# Altium schematic sheet TopLevel.SchDoc
size A2; SheetNumber: 1; SheetTotal: 9
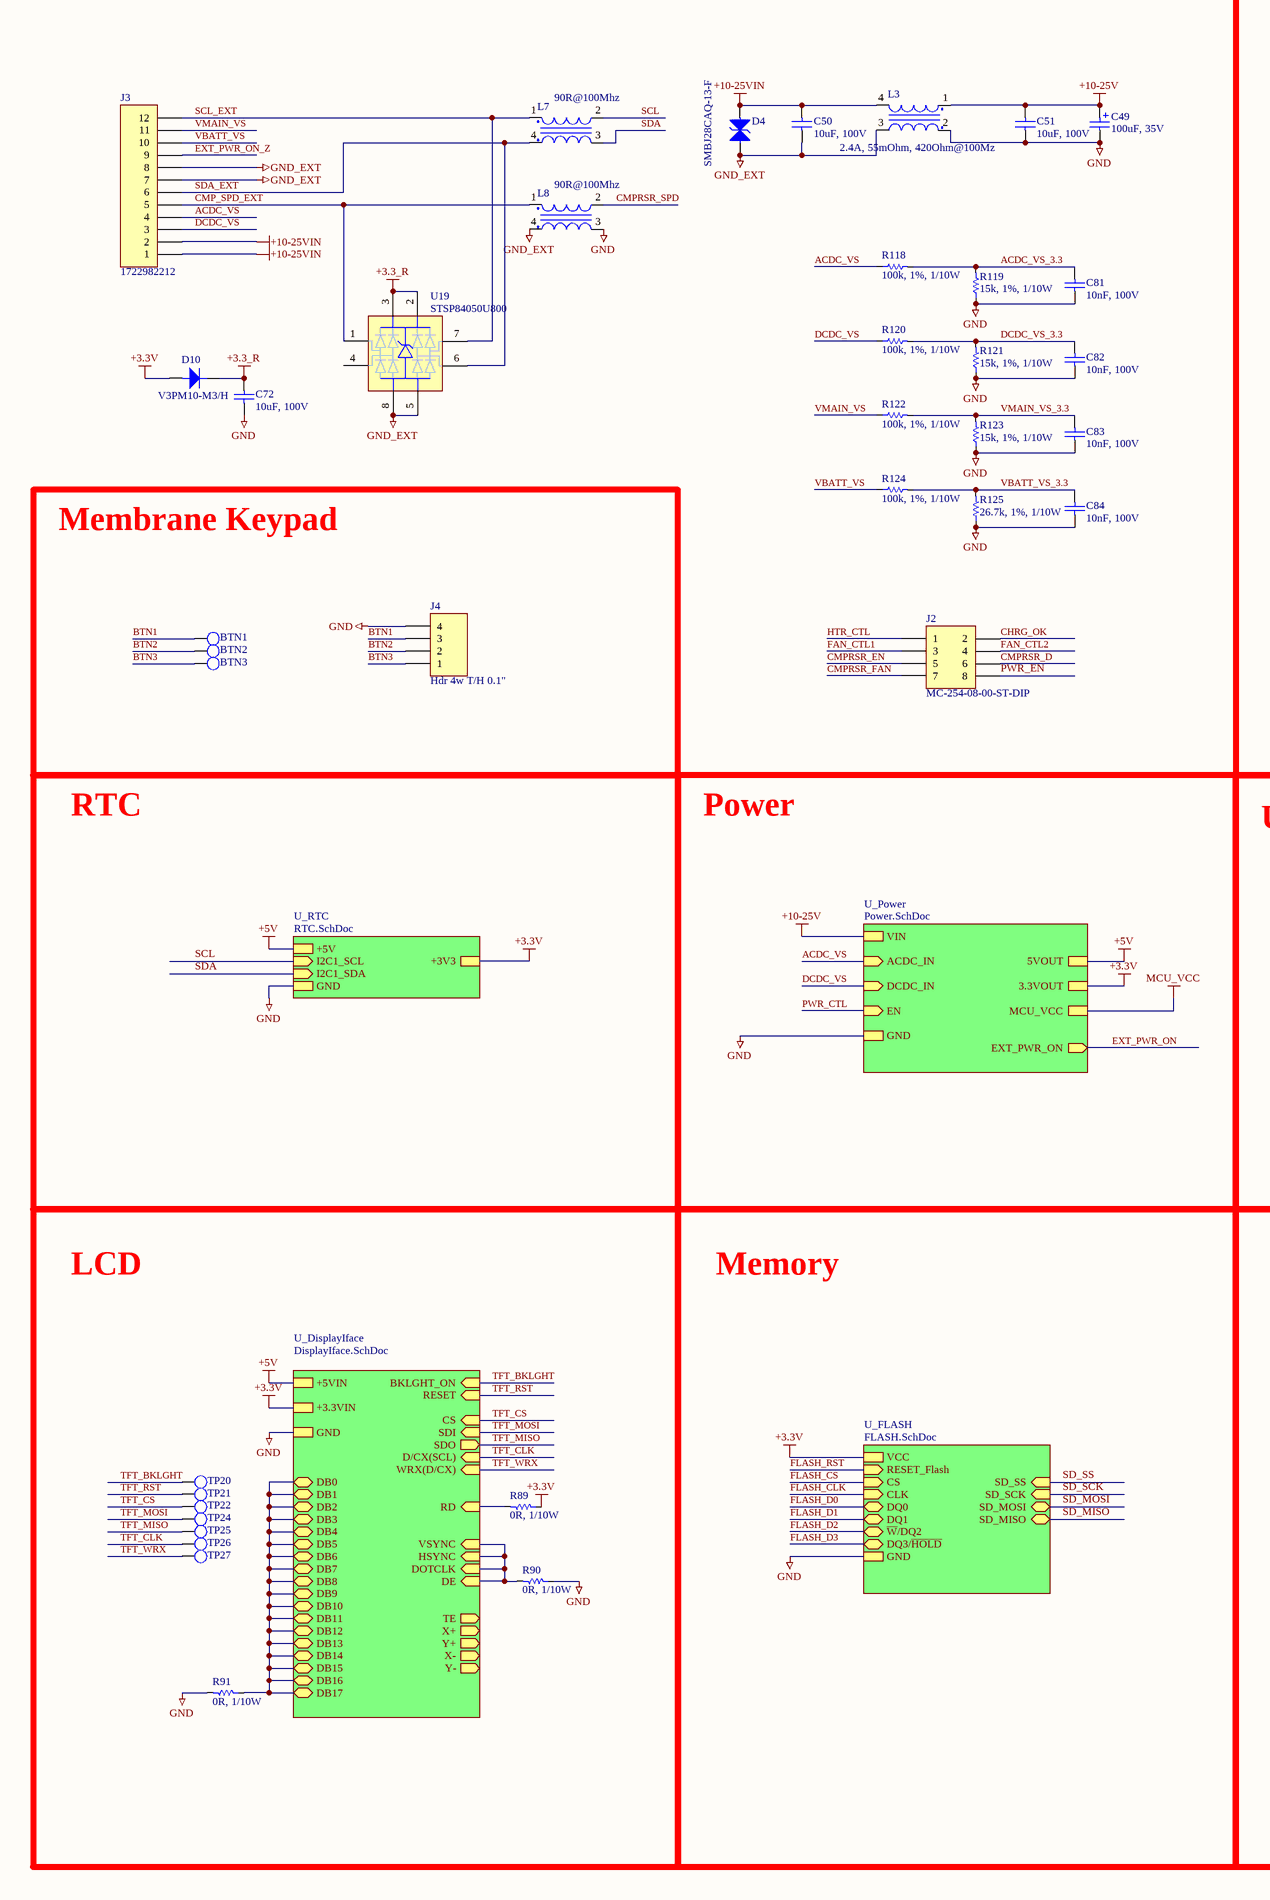
[diagram p0: TopLevel.SchDoc, left]
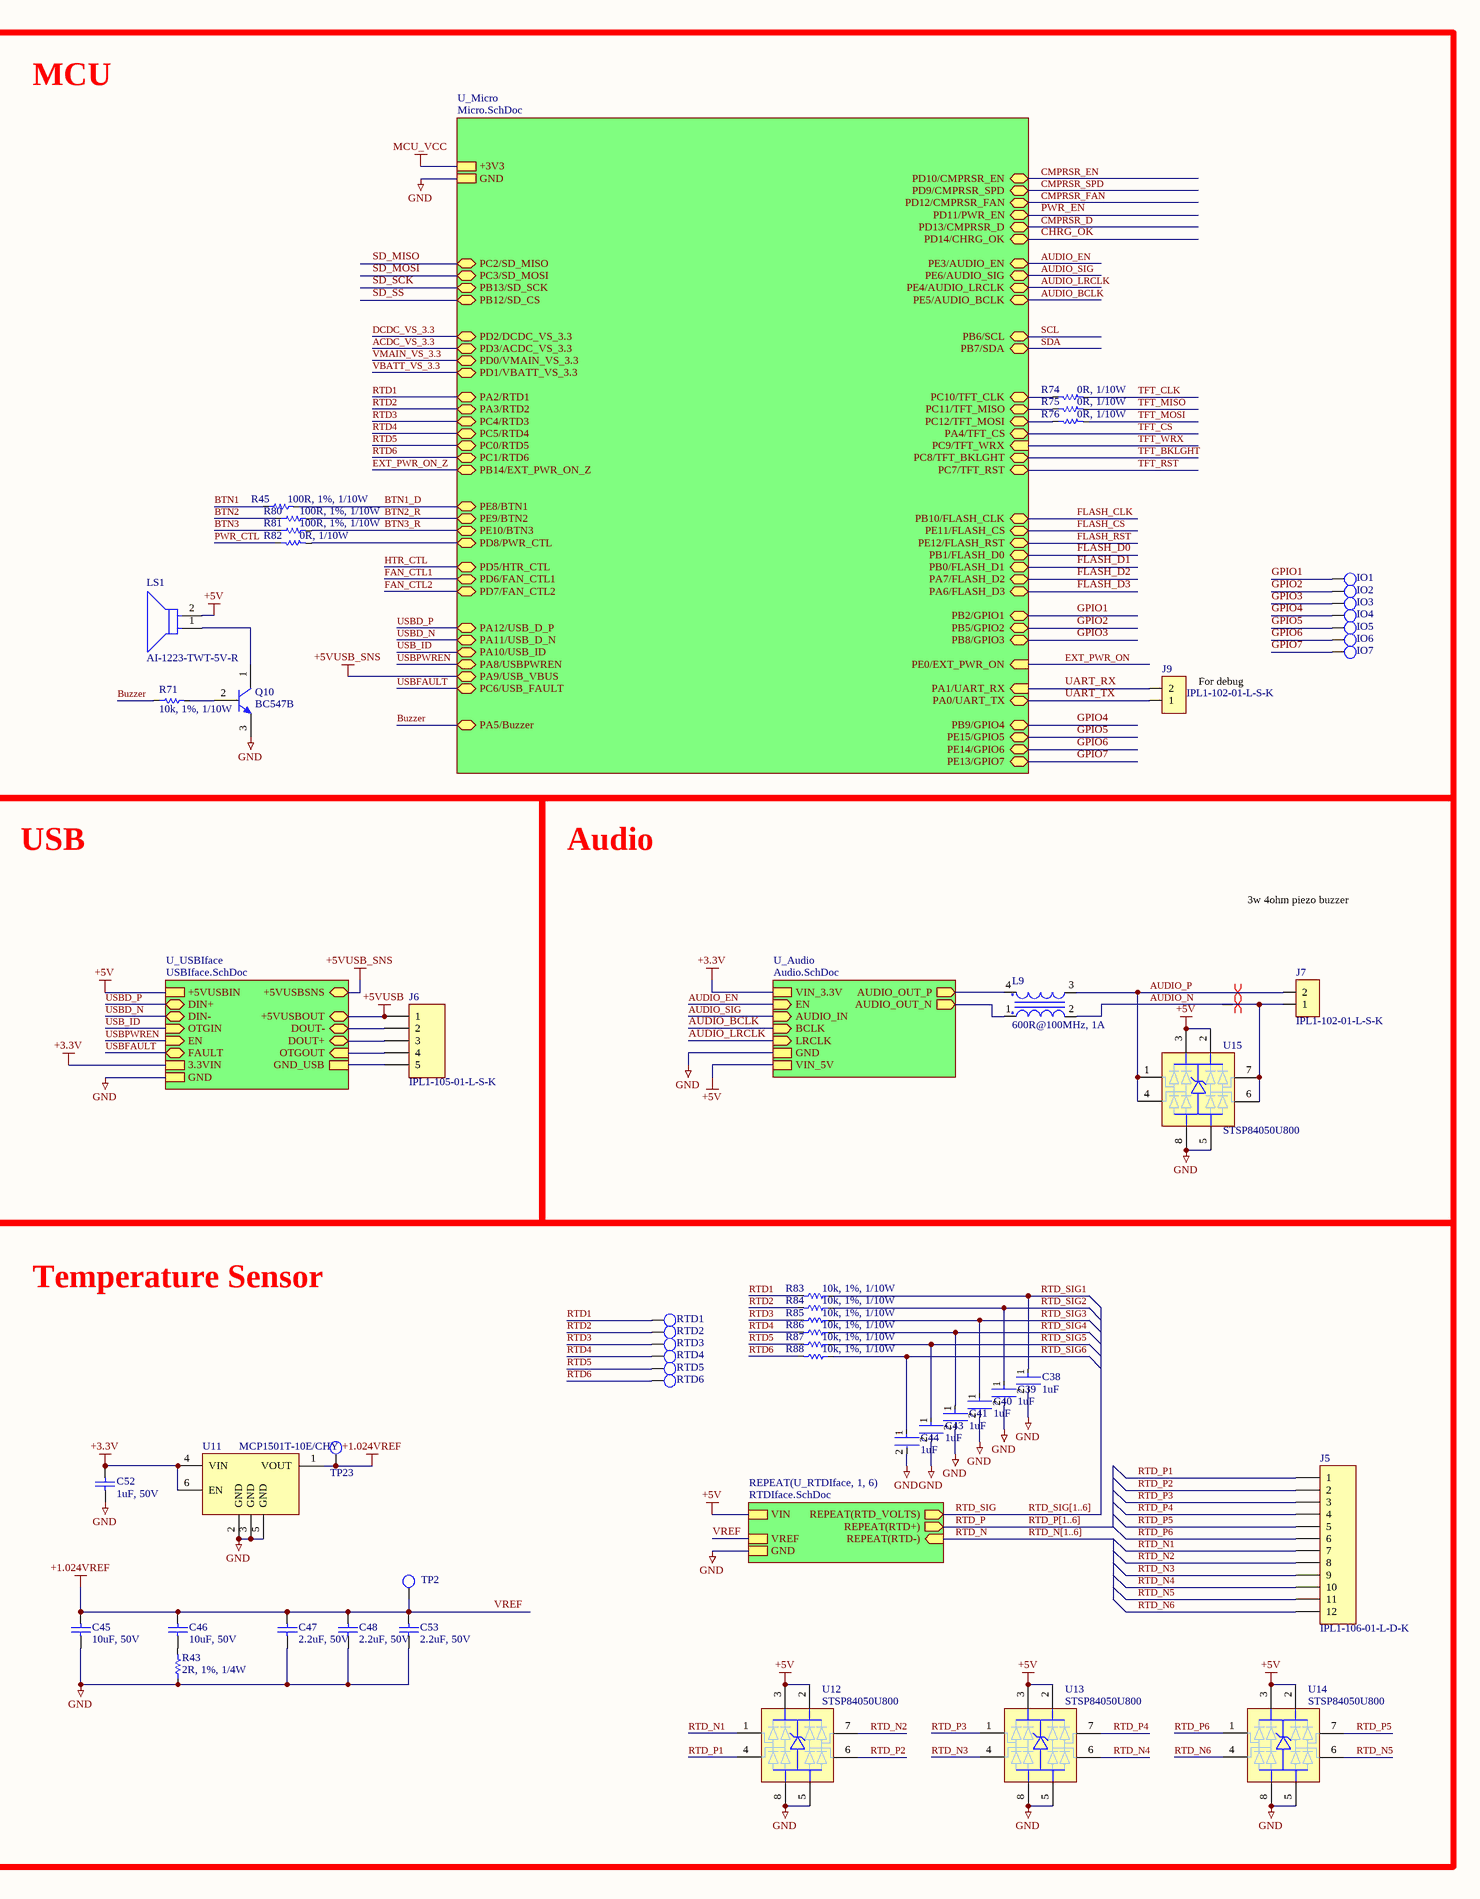
[diagram p1: TopLevel.SchDoc, right]

## Parts
BTN1  2mm  [TEST POINT 40 Mil]  (value not drawn)  (no BOM)
BTN2  2mm  [TEST POINT 40 Mil]  (value not drawn)  (no BOM)
BTN3  2mm  [TEST POINT 40 Mil]  (value not drawn)  (no BOM)
C38  1uF  [FP-CL10B105KO8NNNC-MFG]
C39  1uF  [FP-CL10B105KO8NNNC-MFG]
C40  1uF  [FP-CL10B105KO8NNNC-MFG]
C41  1uF  [FP-CL10B105KO8NNNC-MFG]
C43  1uF  [FP-CL10B105KO8NNNC-MFG]
C44  1uF  [FP-CL10B105KO8NNNC-MFG]
C45  10uF, 50V  [1206]
C46  10uF, 50V  [1206]
C47  2.2uF, 50V  [1206]
C48  2.2uF, 50V  [1206]
C49  100uF, 35V  [CAPAE7866X80L]
C50  10uF, 100V  [1210]
C51  10uF, 100V  [1210]
C52  1uF, 50V  [0805]
C53  2.2uF, 50V  [1206]
C72  10uF, 100V  [1210]
C81  10nF, 100V  [0603]
C82  10nF, 100V  [0603]
C83  10nF, 100V  [0603]
C84  10nF, 100V  [0603]
D4  SMBJ28CAQ-13-F  [SMB]
D10  V3PM10-M3/H  [SMP]
IO1  2mm  [TEST POINT 40 Mil]  (value not drawn)  (no BOM)
IO2  2mm  [TEST POINT 40 Mil]  (value not drawn)  (no BOM)
IO3  2mm  [TEST POINT 40 Mil]  (value not drawn)  (no BOM)
IO4  2mm  [TEST POINT 40 Mil]  (value not drawn)  (no BOM)
IO5  2mm  [TEST POINT 40 Mil]  (value not drawn)  (no BOM)
IO6  2mm  [TEST POINT 40 Mil]  (value not drawn)  (no BOM)
IO7  2mm  [TEST POINT 40 Mil]  (value not drawn)  (no BOM)
J2  MC-254-08-00-ST-DIP  [CONN_206832-0823]
J3  1722982212  [CONN_MOLEX_1722982212]
J4  Hdr 4w T/H 0.1"  [CONN_HDR_FRICTION_LOCK_2.54MM_4]
J5  IPL1-106-01-L-D-K  [CONN_SAMTEC_IPL1-106-XX-X-D]
J6  IPL1-105-01-L-S-K  [CONN_SAMTEC_IPL1-105-XX-X-S]
J7  IPL1-102-01-L-S-K  [CONN_SAMTEC_IPL1-102-XX-X-S]
J9  IPL1-102-01-L-S-K  [CONN_SAMTEC_IPL1-102-XX-X-S]
L3  2.4A, 55mOhm, 420Ohm@100Mz  [CHOKE_SMD_4.7X4.5]
L7  90R@100Mhz  [BOURNS_SRF2012]
L8  90R@100Mhz  [BOURNS_SRF2012]
L9  600R@100MHz, 1A  [DFN260P320X200-4L]
LS1  AI-1223-TWT-5V-R  [FP-AI-1223-TWT-5V-R-MFG]
Q10  BC547B  [ONSC-TO-92-3-29-11]
R43  2R, 1%, 1/4W  [1206]
R45  100R, 1%, 1/10W  [0603]
R71  10k, 1%, 1/10W  [0603]
R74  0R, 1/10W  [0603]
R75  0R, 1/10W  [0603]
R76  0R, 1/10W  [0603]
R80  100R, 1%, 1/10W  [0603]
R81  100R, 1%, 1/10W  [0603]
R82  0R, 1/10W  [0603]
R83  10k, 1%, 1/10W  [0603]
R84  10k, 1%, 1/10W  [0603]
R85  10k, 1%, 1/10W  [0603]
R86  10k, 1%, 1/10W  [0603]
R87  10k, 1%, 1/10W  [0603]
R88  10k, 1%, 1/10W  [0603]
R89  0R, 1/10W  [0603]
R90  0R, 1/10W  [0603]
R91  0R, 1/10W  [0603]
R118  100k, 1%, 1/10W  [0603]
R119  15k, 1%, 1/10W  [0603]
R120  100k, 1%, 1/10W  [0603]
R121  15k, 1%, 1/10W  [0603]
R122  100k, 1%, 1/10W  [0603]
R123  15k, 1%, 1/10W  [0603]
R124  100k, 1%, 1/10W  [0603]
R125  26.7k, 1%, 1/10W  [0603]
RTD1  2mm  [TEST POINT 40 Mil]  (value not drawn)  (no BOM)
RTD2  2mm  [TEST POINT 40 Mil]  (value not drawn)  (no BOM)
RTD3  2mm  [TEST POINT 40 Mil]  (value not drawn)  (no BOM)
RTD4  2mm  [TEST POINT 40 Mil]  (value not drawn)  (no BOM)
RTD5  2mm  [TEST POINT 40 Mil]  (value not drawn)  (no BOM)
RTD6  2mm  [TEST POINT 40 Mil]  (value not drawn)  (no BOM)
TP2  2mm  [TEST POINT 40 Mil]  (value not drawn)  (no BOM)
TP20  2mm  [TEST POINT 40 Mil]  (value not drawn)  (no BOM)
TP21  2mm  [TEST POINT 40 Mil]  (value not drawn)  (no BOM)
TP22  2mm  [TEST POINT 40 Mil]  (value not drawn)  (no BOM)
TP23  2mm  [TEST POINT 40 Mil]  (value not drawn)  (no BOM)
TP24  2mm  [TEST POINT 40 Mil]  (value not drawn)  (no BOM)
TP25  2mm  [TEST POINT 40 Mil]  (value not drawn)  (no BOM)
TP26  2mm  [TEST POINT 40 Mil]  (value not drawn)  (no BOM)
TP27  2mm  [TEST POINT 40 Mil]  (value not drawn)  (no BOM)
U11  MCP1501T-10E/CHY  [SOT23-6]
U12  STSP84050U800  [SOIC127P600X163-8N]
U13  STSP84050U800  [SOIC127P600X163-8N]
U14  STSP84050U800  [SOIC127P600X163-8N]
U15  STSP84050U800  [SOIC127P600X163-8N]
U19  STSP84050U800  [SOIC127P600X163-8N]

## Blocks framed on the sheet
MCU: IO1-IO7 J9 LS1 Q10 R45 R71 R74-R76 R80-R82
Membrane Keypad: BTN1-BTN3 J4
USB: J6
Audio: J7 L9 U15
LCD: R89-R91 TP20-TP22 TP24-TP27
Temperature Sensor: C38-C41 C43-C48 C52 C53 J5 R43 R83-R88 RTD1-RTD6 TP2 TP23 U11-U14

## Sub-sheets
REPEAT(U_RTDIface, 1, 6) = RTDIface.SchDoc: REPEAT(RTD_VOLTS) (out), GND, VIN, REPEAT(RTD+) (out), REPEAT(RTD-) (in), VREF
U_Audio = Audio.SchDoc: AUDIO_IN (in), EN (in), AUDIO_OUT_P (out), AUDIO_OUT_N (out), VIN_3.3V, BCLK (in), LRCLK (in), GND, VIN_5V
U_DisplayIface = DisplayIface.SchDoc: DB0 (bidir), DB1 (bidir), DB2 (bidir), DB3 (bidir), DB4 (bidir), DB5 (bidir), DB6 (bidir), DB7 (bidir), DB8 (bidir), DB9 (bidir), DB10 (bidir), DB11 (bidir), DB12 (bidir), DB13 (bidir), DB14 (bidir), DB15 (bidir), DB16 (bidir), DB17 (bidir), RD (in), +5VIN, +3.3VIN, GND, SDO (out), RESET (in), SDI (in), WRX(D/CX) (in), D/CX(SCL) (in), CS (in), BKLGHT_ON (in), TE (out), X+ (out), Y+ (out), X- (out), Y- (out), VSYNC (in), HSYNC (in), DOTCLK (in), DE (in)
U_FLASH = FLASH.SchDoc: VCC, RESET_Flash (in), CS (in), CLK (in), DQ0 (bidir), DQ1 (bidir), ~{W}/DQ2 (bidir), GND, DQ3/~{HOLD} (bidir), SD_SS (in), SD_SCK (in), SD_MOSI (bidir), SD_MISO (bidir)
U_Micro = Micro.SchDoc: PA10/USB_ID (bidir), PB10/FLASH_CLK (bidir), +3V3, GND, PE6/AUDIO_SIG (bidir), PA8/USBPWREN (bidir), PD13/CMPRSR_D (bidir), PB7/SDA (bidir), PA3/RTD2 (bidir), PD7/FAN_CTL2 (bidir), PC1/RTD6 (bidir), PC2/SD_MISO (bidir), PA11/USB_D_N (bidir), PA12/USB_D_P (bidir), PC3/SD_MOSI (bidir), PE12/FLASH_RST (bidir), PC8/TFT_BKLGHT (bidir), PC7/TFT_RST (bidir), PE11/FLASH_CS (bidir), PD10/CMPRSR_EN (bidir), PC9/TFT_WRX (in), PC10/TFT_CLK (bidir), PC11/TFT_MISO (bidir), PC12/TFT_MOSI (bidir), PA4/TFT_CS (bidir), PD9/CMPRSR_SPD (bidir), PB13/SD_SCK (bidir), PB12/SD_CS (bidir), PB6/SCL (bidir), PD6/FAN_CTL1 (bidir), PD14/CHRG_OK (bidir), PB14/EXT_PWR_ON_Z (bidir), PC4/RTD3 (bidir), PC5/RTD4 (bidir), PC0/RTD5 (bidir), PD8/PWR_CTL (bidir), PD5/HTR_CTL (bidir), PE8/BTN1 (bidir), PD0/VMAIN_VS_3.3 (bidir), PD1/VBATT_VS_3.3 (bidir), PD3/ACDC_VS_3.3 (bidir), PD2/DCDC_VS_3.3 (bidir), PE3/AUDIO_EN (bidir), PA2/RTD1 (bidir), PE9/BTN2 (bidir), PE10/BTN3 (bidir), PD12/CMPRSR_FAN (bidir), PE0/EXT_PWR_ON (in), PA5/Buzzer (bidir), PB1/FLASH_D0 (bidir), PB0/FLASH_D1 (bidir), PA7/FLASH_D2 (bidir), PA6/FLASH_D3 (bidir), PA9/USB_VBUS (bidir), PC6/USB_FAULT (bidir), PE4/AUDIO_LRCLK (bidir), PE5/AUDIO_BCLK (bidir), PA1/UART_RX (in), PA0/UART_TX (bidir), PB2/GPIO1 (bidir), PB8/GPIO3 (bidir), PB5/GPIO2 (bidir), PB9/GPIO4 (bidir), PE15/GPIO5 (bidir), PE14/GPIO6 (bidir), PE13/GPIO7 (bidir), PD11/PWR_EN (bidir)
U_Power = Power.SchDoc: EN (in), VIN, ACDC_IN (in), GND, DCDC_IN (in), 5VOUT, 3.3VOUT, EXT_PWR_ON (out), MCU_VCC
U_RTC = RTC.SchDoc: I2C1_SCL (in), +5V, GND, +3V3, I2C1_SDA (in)
U_USBIface = USBIface.SchDoc: +5VUSBIN, DIN+ (bidir), DIN- (bidir), OTGIN (in), GND, EN (in), FAULT (bidir), +5VUSBOUT (bidir), DOUT+ (bidir), DOUT- (bidir), OTGOUT (in), +5VUSBSNS (bidir), GND_USB, 3.3VIN

## Nets
+3.3_R: C72.2 D10.2(K) U19.2 U19.3
+3.3V: C52.2 D10.1(A) R89.1 U11.4(VIN) U11.6(EN) ; sheet U_Power/3.3VOUT, sheet U_DisplayIface/+3.3VIN, sheet U_USBIface/3.3VIN, sheet U_Audio/VIN_3.3V, sheet U_FLASH/VCC, sheet U_RTC/+3V3
+5V: LS1.2(A) U12.2 U12.3 U13.2 U13.3 U14.2 U14.3 U15.2 U15.3 ; sheet U_Power/5VOUT, sheet REPEAT(U_RTDIface, 1, 6)/VIN, sheet U_DisplayIface/+5VIN, sheet U_USBIface/+5VUSBIN, sheet U_Audio/VIN_5V, sheet U_RTC/+5V
+5VUSB: J6.1 ; sheet U_USBIface/+5VUSBOUT
+5VUSB_SNS: sheet U_Micro/PA9/USB_VBUS, sheet U_USBIface/+5VUSBSNS
+10-25V: C49.1 C51.2 L3.1 ; sheet U_Power/VIN
+10-25VIN: C50.2 D4.2(K) J3.1 J3.2 L3.4
GND: C38.2 C39.2 C40.2 C41.2 C43.2 C44.2 C45.1 C47.1 C48.1 C49.2 C51.1 C52.1 C53.1 C72.1 C81.1 C82.1 C83.1 C84.1 J4.4 L3.2 L8.3 Q10.3(E) R43.1 R90.1 R91.2 R119.1 R121.1 R123.1 R125.1 U11.2(GND) U11.3(GND) U11.5(GND) U12.5 U12.8 U13.5 U13.8 U14.5 U14.8 U15.5 U15.8 ; sheet U_Micro/GND, sheet U_Power/GND, sheet REPEAT(U_RTDIface, 1, 6)/GND, sheet U_DisplayIface/GND, sheet U_USBIface/GND, sheet U_Audio/GND, sheet U_FLASH/GND, sheet U_RTC/GND
GND_EXT: C50.1 D4.1(A) J3.7 J3.8 L3.3 L8.4 U19.5 U19.8
MCU_VCC: sheet U_Micro/+3V3, sheet U_Power/MCU_VCC
VREF: C45.2 C46.2 C47.2 C48.2 C53.2 TP2.1(TP) TP23.1(TP) U11.1(VOUT) ; sheet REPEAT(U_RTDIface, 1, 6)/VREF  [also labelled +1.024VREF]
ACDC_VS: J3.4 R118.1 ; sheet U_Power/ACDC_IN
ACDC_VS_3.3: C81.2 R118.2 R119.2 ; sheet U_Micro/PD3/ACDC_VS_3.3
AUDIO_BCLK: sheet U_Micro/PE5/AUDIO_BCLK, sheet U_Audio/BCLK
AUDIO_EN: sheet U_Micro/PE3/AUDIO_EN, sheet U_Audio/EN
AUDIO_LRCLK: sheet U_Micro/PE4/AUDIO_LRCLK, sheet U_Audio/LRCLK
AUDIO_N: J7.1 L9.2 U15.6 U15.7
AUDIO_P: J7.2 L9.3 U15.1 U15.4
AUDIO_SIG: sheet U_Micro/PE6/AUDIO_SIG, sheet U_Audio/AUDIO_IN
BTN1: BTN1.1(TP) J4.3 R45.1
BTN1_D: R45.2 ; sheet U_Micro/PE8/BTN1
BTN2: BTN2.1(TP) J4.2 R80.1
BTN2_R: R80.2 ; sheet U_Micro/PE9/BTN2
BTN3: BTN3.1(TP) J4.1 R81.1
BTN3_R: R81.2 ; sheet U_Micro/PE10/BTN3
Buzzer: R71.1 ; sheet U_Micro/PA5/Buzzer
CHRG_OK: J2.2 ; sheet U_Micro/PD14/CHRG_OK
CMP_SPD_EXT: J3.5 L8.1 U19.1
CMPRSR_D: J2.6 ; sheet U_Micro/PD13/CMPRSR_D
CMPRSR_EN: J2.5 ; sheet U_Micro/PD10/CMPRSR_EN
CMPRSR_FAN: J2.7 ; sheet U_Micro/PD12/CMPRSR_FAN
CMPRSR_SPD: L8.2 ; sheet U_Micro/PD9/CMPRSR_SPD
DCDC_VS: J3.3 R120.1 ; sheet U_Power/DCDC_IN
DCDC_VS_3.3: C82.2 R120.2 R121.2 ; sheet U_Micro/PD2/DCDC_VS_3.3
EXT_PWR_ON: sheet U_Micro/PE0/EXT_PWR_ON, sheet U_Power/EXT_PWR_ON
EXT_PWR_ON_Z: J3.9 ; sheet U_Micro/PB14/EXT_PWR_ON_Z
FAN_CTL1: J2.3 ; sheet U_Micro/PD6/FAN_CTL1
FAN_CTL2: J2.4 ; sheet U_Micro/PD7/FAN_CTL2
FLASH_CLK: sheet U_Micro/PB10/FLASH_CLK, sheet U_FLASH/CLK
FLASH_CS: sheet U_Micro/PE11/FLASH_CS, sheet U_FLASH/CS
FLASH_D0: sheet U_Micro/PB1/FLASH_D0, sheet U_FLASH/DQ0
FLASH_D1: sheet U_Micro/PB0/FLASH_D1, sheet U_FLASH/DQ1
FLASH_D2: sheet U_Micro/PA7/FLASH_D2, sheet U_FLASH/~{W}/DQ2
FLASH_D3: sheet U_Micro/PA6/FLASH_D3, sheet U_FLASH/DQ3/~{HOLD}
FLASH_RST: sheet U_Micro/PE12/FLASH_RST, sheet U_FLASH/RESET_Flash
GPIO1: IO1.1(TP) ; sheet U_Micro/PB2/GPIO1
GPIO2: IO2.1(TP) ; sheet U_Micro/PB5/GPIO2
GPIO3: IO3.1(TP) ; sheet U_Micro/PB8/GPIO3
GPIO4: IO4.1(TP) ; sheet U_Micro/PB9/GPIO4
GPIO5: IO5.1(TP) ; sheet U_Micro/PE15/GPIO5
GPIO6: IO6.1(TP) ; sheet U_Micro/PE14/GPIO6
GPIO7: IO7.1(TP) ; sheet U_Micro/PE13/GPIO7
HTR_CTL: J2.1 ; sheet U_Micro/PD5/HTR_CTL
PWR_CTL: R82.1 ; sheet U_Power/EN
PWR_EN: J2.8 ; sheet U_Micro/PD11/PWR_EN
RTD1: R83.2 RTD1.1(TP) ; sheet U_Micro/PA2/RTD1
RTD2: R84.2 RTD2.1(TP) ; sheet U_Micro/PA3/RTD2
RTD3: R85.2 RTD3.1(TP) ; sheet U_Micro/PC4/RTD3
RTD4: R86.2 RTD4.1(TP) ; sheet U_Micro/PC5/RTD4
RTD5: R87.2 RTD5.1(TP) ; sheet U_Micro/PC0/RTD5
RTD6: R88.2 RTD6.1(TP) ; sheet U_Micro/PC1/RTD6
RTD_N: sheet REPEAT(U_RTDIface, 1, 6)/REPEAT(RTD-)
RTD_N1: J5.7 U12.1
RTD_N2: J5.8 U12.7
RTD_N3: J5.9 U13.4
RTD_N4: J5.10 U13.6
RTD_N5: J5.11 U14.6
RTD_N6: J5.12 U14.4
RTD_P: sheet REPEAT(U_RTDIface, 1, 6)/REPEAT(RTD+)
RTD_P1: J5.1 U12.4
RTD_P2: J5.2 U12.6
RTD_P3: J5.3 U13.1
RTD_P4: J5.4 U13.7
RTD_P5: J5.5 U14.7
RTD_P6: J5.6 U14.1
RTD_SIG: sheet REPEAT(U_RTDIface, 1, 6)/REPEAT(RTD_VOLTS)
RTD_SIG1: C38.1 R83.1
RTD_SIG2: C39.1 R84.1
RTD_SIG3: C40.1 R85.1
RTD_SIG4: C41.1 R86.1
RTD_SIG5: C43.1 R87.1
RTD_SIG6: C44.1 R88.1
SCL: L7.2 ; sheet U_Micro/PB6/SCL, sheet U_RTC/I2C1_SCL
SCL_EXT: J3.12 L7.1 U19.7
SD_MISO: sheet U_Micro/PC2/SD_MISO, sheet U_FLASH/SD_MISO
SD_MOSI: sheet U_Micro/PC3/SD_MOSI, sheet U_FLASH/SD_MOSI
SD_SCK: sheet U_Micro/PB13/SD_SCK, sheet U_FLASH/SD_SCK
SD_SS: sheet U_Micro/PB12/SD_CS, sheet U_FLASH/SD_SS
SDA: L7.3 ; sheet U_Micro/PB7/SDA, sheet U_RTC/I2C1_SDA
SDA_EXT: J3.6 L7.4 U19.6
TFT_BKLGHT: TP20.1(TP) ; sheet U_Micro/PC8/TFT_BKLGHT, sheet U_DisplayIface/BKLGHT_ON
TFT_CLK: R74.2 TP26.1(TP) ; sheet U_DisplayIface/D/CX(SCL)
TFT_CS: TP22.1(TP) ; sheet U_Micro/PA4/TFT_CS, sheet U_DisplayIface/CS
TFT_MISO: R75.2 TP25.1(TP) ; sheet U_DisplayIface/SDO
TFT_MOSI: R76.2 TP24.1(TP) ; sheet U_DisplayIface/SDI
TFT_RST: TP21.1(TP) ; sheet U_Micro/PC7/TFT_RST, sheet U_DisplayIface/RESET
TFT_WRX: TP27.1(TP) ; sheet U_Micro/PC9/TFT_WRX, sheet U_DisplayIface/WRX(D/CX)
UART_RX: J9.2 ; sheet U_Micro/PA1/UART_RX
UART_TX: J9.1 ; sheet U_Micro/PA0/UART_TX
USB_ID: sheet U_Micro/PA10/USB_ID, sheet U_USBIface/OTGIN
USBD_N: sheet U_Micro/PA11/USB_D_N, sheet U_USBIface/DIN-
USBD_P: sheet U_Micro/PA12/USB_D_P, sheet U_USBIface/DIN+
USBFAULT: sheet U_Micro/PC6/USB_FAULT, sheet U_USBIface/FAULT
USBPWREN: sheet U_Micro/PA8/USBPWREN, sheet U_USBIface/EN
VBATT_VS: J3.10 R124.1
VBATT_VS_3.3: C84.2 R124.2 R125.2 ; sheet U_Micro/PD1/VBATT_VS_3.3
VMAIN_VS: J3.11 R122.1
VMAIN_VS_3.3: C83.2 R122.2 R123.2 ; sheet U_Micro/PD0/VMAIN_VS_3.3
NetC46_1: C46.1 R43.2
NetJ6_2: J6.2 ; sheet U_USBIface/DOUT-
NetJ6_3: J6.3 ; sheet U_USBIface/DOUT+
NetJ6_4: J6.4 ; sheet U_USBIface/OTGOUT
NetJ6_5: J6.5 ; sheet U_USBIface/GND_USB
NetL9_1: L9.1 ; sheet U_Audio/AUDIO_OUT_N
NetL9_4: L9.4 ; sheet U_Audio/AUDIO_OUT_P
NetLS1_1: LS1.1(C) Q10.1(C)
NetQ10_2: Q10.2(B) R71.2
NetR74_1: R74.1 ; sheet U_Micro/PC10/TFT_CLK
NetR75_1: R75.1 ; sheet U_Micro/PC11/TFT_MISO
NetR76_1: R76.1 ; sheet U_Micro/PC12/TFT_MOSI
NetR82_2: R82.2 ; sheet U_Micro/PD8/PWR_CTL
NetR89_2: R89.2 ; sheet U_DisplayIface/RD
NetR90_2: R90.2 ; sheet U_DisplayIface/VSYNC, sheet U_DisplayIface/HSYNC, sheet U_DisplayIface/DOTCLK, sheet U_DisplayIface/DE
NetR91_1: R91.1 ; sheet U_DisplayIface/DB0, sheet U_DisplayIface/DB1, sheet U_DisplayIface/DB2, sheet U_DisplayIface/DB3, sheet U_DisplayIface/DB4, sheet U_DisplayIface/DB5, sheet U_DisplayIface/DB6, sheet U_DisplayIface/DB7, sheet U_DisplayIface/DB8, sheet U_DisplayIface/DB9, sheet U_DisplayIface/DB10, sheet U_DisplayIface/DB11, sheet U_DisplayIface/DB12, sheet U_DisplayIface/DB13, sheet U_DisplayIface/DB14, sheet U_DisplayIface/DB15, sheet U_DisplayIface/DB16, sheet U_DisplayIface/DB17

Not connected (* = marked no-connect by the designer): U19 4

## Buses and harness runs
bus RTD_N[1..6]
bus RTD_P[1..6]
bus RTD_SIG[1..6]

## Layout directives
differential pair: AUDIO_N, AUDIO_P

## Notes on the sheet
- For debug
- RTC
- Power
- 3w 4ohm piezo buzzer
- Memory

## Library data of the parts
BTN1-BTN3 IO1-IO7 RTD1-RTD6 TP2 TP20-TP27 = NS00254: Testpoint 2mm round; Part Number: NS00254; Type: Mechanical; Value: 2mm
C38-C41 C43 C44 = CMP-2000-06093-2: CAP CER 1UF 16V X7R 0603; Manufacturer: Samsung Electro-Mechanics America, Inc; Manufacturer Part Number: CL10B105KO8NNNC; Temperature Coefficient: 15%; Material: Ceramic; Tolerance: 10%; Voltage Rating: 16V; Automotive: No; ComponentLink2Description: Datasheet; Device Class L3: Ceramic Capacitors; Capacitance: 1uF; Temperature Characteristic: X7R; Temperature Range High: +125°C; Digikey Description: CAP CER 1UF 16V X7R 0603; Device Class L2: Capacitors; Octopart: https://octopart.com/cl10b105ko8nnnc-samsung-19018973; ComponentLink2URL: http://www.samsungsem.com/global/front/downloadcms.do?path=%2F%2Fglobal%2F%2Fsupport%2F%2Fproduct-search%2F%2Fmlcc%2F%2F__icsFiles%2F%2Fafieldfile%2F%2F2019%2F%2F06%2F%2F18&fileName=CL10B105KO8NNNC-19.pdf; Lead Free: Yes; Height: 0.9mm; Package: CL10B105KO8NNNC; Temperature Range Low: -55°C; Value: 1uF; Device Class L1: Passive Components; RoHS: TRUE; Temperature: -55°C to +125°C; Category: Cap; Ipc Land Pattern Name: CAPC16080X80; Supplier 1: Digikey; Supplier Part Number: 1276-1019-2-ND
C45 C46 = NS00832: CAP CER 10UF 50V X7R 1206; Type: C; Alternatives: Generic; Part Number: NS00832; Value: 10uF, 50V; Supplier 1: Digi-Key; Supplier Part Number 1: 1276-6767-1-ND
C47 C48 C53 = NS00824: CAP CER 2.2UF 50V X7R 1206; Type: C; Alternatives: Generic; Part Number: NS00824; Value: 2.2uF, 50V; Supplier 1: Digi-Key; Supplier Part Number 1: 1276-3137-1-ND
C49 = NS00911: CAP ALUM 100UF 20% 35V SMD; Type: C; Alternatives: Generic; Part Number: NS00911; Value: 100uF, 35V; Supplier 1: Digi-Key; Supplier Part Number 1: PCE5051CT-ND
C50 C51 C72 = NS00779: MLCC 10UF 100V X7S 1210; Type: C; Alternatives: Generic; Part Number: NS00779; Value: 10uF, 100V; Supplier 1: Digi-Key; Supplier Part Number 1: 1276-CL32Y106KCVZNWECT-ND
C52 = NS00871: CAP CER 1UF 50V X7R 0805; Type: C; Alternatives: Generic; Part Number: NS00871; Value: 1uF, 50V; Supplier 1: Digi-Key; Supplier Part Number 1: 1276-6470-1-ND
C81-C84 = NS00848: CAP CER 10000PF 100V C0G 0603; Type: C; Alternatives: Generic; Part Number: NS00848; Value: 10nF, 100V; Supplier 1: Digi-Key; Supplier Part Number 1: 445-172665-1-ND
D4 = NS00890: TVS DIODE 28VWM 45.4VC SMB; Part Number: NS00890; Type: Diode; Value: SMBJ28CAQ-13-F; ComponentLink1Description: Datasheet; ComponentLink1URL: H:\Doc\Diodes\SMBJ6.5CAQ-SMBJ100CAQ.pdf; Supplier 1: Digi-Key; Supplier Part Number 1: SMBJ28CAQ-13-FDICT-ND
D10 = NS00857: SCHOTTKY RECTIFIER 3A 100V SMP; Part Number: NS00857; Type: Diode; Value: V3PM10-M3/H; ComponentLink1Description: Datasheet; ComponentLink1URL: H:\Doc\Vishay\v3pm10.pdf; Supplier 1: Digi-Key; Supplier Part Number 1: 112-V3PM10-M3/HCT-ND
J2 = Header 4X2: Header, 4-Pin, Dual row; LatestRevisionDate: 17-Jul-2002; LatestRevisionNote: Re-released for DXP Platform.; Publisher: Altium Limited; Supplier 1: Farnell; Supplier Part Number 1: MC-254-08-00-ST-DIP
J3 = NS00894: CONN HEADER VERT 12POS 3.5MM; Part Number: NS00894; Type: Connector; Value: 1722982212; ComponentLink1Description: Datasheet; ComponentLink1URL: H:\Doc\Molex\1722982212_PCB_HEADERS.pdf; ComponentLink2Description: Application Specification; ComponentLink2URL: H:\Doc\Molex\AS-172323-0001-001.pdf; ComponentLink3Description: Drawing; ComponentLink3URL: H:\Doc\Molex\1722982212_sd.pdf; Supplier 1: Digi-Key; Supplier Part Number 1: WM11767-ND
J4 = NS00337: 4 Positions Header, Unshrouded Connector 0.100" (2.54mm) Through Hole Gold; Alternatives: Generic; Part Number: NS00337; Type: Connector; Value: Hdr 4w T/H 0.1"; ComponentLink1Description: Datasheet; ComponentLink1URL: H:\Doc\Molex\PS-10-07.pdf; ComponentLink2Description: Drawing; ComponentLink2URL: H:\Doc\Molex\022112022_sd.pdf; Supplier 1: Digi-Key; Supplier Part Number 1: WM2702-ND
J5 = NS00892: CONN HEADER VERT 12POS 2.54MM; Part Number: NS00892; Type: Connector; Value: IPL1-106-01-L-D-K; ComponentLink1Description: Datasheet; ComponentLink1URL: H:\Doc\Samtec\100_mini_mate.pdf; ComponentLink2Description: Dimensions; ComponentLink2URL: H:\Doc\Samtec\ipl1.pdf; Supplier 1: Digi-Key; Supplier Part Number 1: SAM8941-ND
J6 = NS00898: CONN HEADER VERT 5POS 2.54MM; Part Number: NS00898; Type: Connector; Value: IPL1-105-01-L-S-K; ComponentLink1Description: Datasheet; ComponentLink1URL: H:\Doc\Samtec\100_mini_mate.pdf; ComponentLink2Description: Dimensions; ComponentLink2URL: H:\Doc\Samtec\ipl1.pdf; Supplier 1: Digi-Key; Supplier Part Number 1: SAM10577-ND
J7 J9 = NS00896: CONN HEADER VERT 2POS 2.54MM; Part Number: NS00896; Type: Connector; Value: IPL1-102-01-L-S-K; ComponentLink1Description: Datasheet; ComponentLink1URL: H:\Doc\Samtec\100_mini_mate.pdf; ComponentLink2Description: Dimensions; ComponentLink2URL: H:\Doc\Samtec\ipl1.pdf; Supplier 1: Digi-Key; Supplier Part Number 1: SAM8824-ND
L3 = NS00257: CHOKE COMMON MODE 420 OHM SMD; Type: Inductor; Part Number: NS00257; Value: 2.4A, 55mOhm, 420Ohm@100Mz; ComponentLink1Description: Datasheet; ComponentLink1URL: H:\Doc\TDK\cmf_commercial_power_acm4520_en.pdf; Supplier 1: Digi-Key; Supplier Part Number 1: 445-8644-1-ND
L7 L8 = NS00042: INDUCTOR COMMON MODE 90 OHM 25%; Part Number: NS00042; Type: Inductor; Value: 90R@100Mhz; ComponentLink1Description: Datasheet; ComponentLink1URL: H:\Doc\Bourns\SRF2012A.pdf; Supplier 1: Digi-Key; Supplier Part Number 1: SRF2012-900YATR-ND
L9 = NS00953: CMC 1A 2LN 600 OHM SMD; Type: Inductor; Part Number: NS00953; Value: 600R@100MHz, 1A; ComponentLink1Description: Datasheet; ComponentLink1URL: H:\Doc\pulse\datasheet_w719_1608373692.pdf; Supplier 1: Digi-Key; Supplier Part Number 1: 553-PE-1210CCMC601STSCT-ND
LS1 = CMP-231724-000001-1: AUDIO MAGNETIC INDICATOR 3-7V TH; Input Type: DC; Bandwidth: 2.3kHz; Nominal Supply Voltage (DC): 5V; Max Supply Current: 30mA; Washable: Yes; Max Supply Voltage (DC): 7V; Min Supply Voltage: 3V; Series: AI; Width: 12mm; REACH SVHC: No SVHC; Contact Plating: Tin; Frequency: 2.3kHz; Operating Supply Current: 30mA; Weight: 0.01lb; Current Rating: 30mA; Mount: Through Hole; Packaging: Tray; Length: 12mm; Lead Free: Lead Free; Color: Black; Input Current: 30mA; Min Operating Temperature: -40°C; Self Resonant Frequency: 2.3kHz; Sensing Method: Magnetic; Voltage Rating (DC): 5V; Height: 9.5mm; Termination: PC Pins; Min Supply Voltage (DC): 3V; Package Quantity: 100; Max Supply Voltage: 7V; Diameter: 12mm; Max Operating Temperature: 85°C; Supplier 1: Digi-Key; Supplier Part Number 1: 668-1019-ND
Q10 = CMP-1048-01467-1: Amplifier Transistor, NPN Silicon, 3-Pin TO-92, Bulk Box; Manufacturer: On Semiconductor; IC Continuous (A): 0.1; fT Min (MHz): 150; DatasheetVersion: Rev. 7; ComponentLink1URL: http://www.onsemi.com/; Polarity: NPN; RoHS: FALSE; ComponentLink1Description: Manufacturer URL; Packing: Bulk Box; PackageDescription: 3-Pin Transistor Outline, Body 4.825 x 3.685 mm, Pitch 1.27 mm; ComponentLink3URL: http://www.onsemi.cn/pub_link/Collateral/2N6426-D.PDF; ComponentLink2Description: Datasheet; PackageVersion: Rev. AM; PackageReference: TO-92-3-29-11_AM_SL; ComponentLink3Description: Package Specification; Mounting Technology: Through Hole; PartNumber: BC547B; ComponentLink2URL: http://www.onsemi.com/pub_link/Collateral/BC546-D.PDF; Supplier 1: Digi-Key; Supplier Part Number 1: BC547BFS-ND
R43 = NS00946: RES 2 OHM 1% 1/4W 1206; Alternatives: Generic; Part Number: NS00946; Type: R; Value: 2R, 1%, 1/4W; Supplier 1: Digi-Key; Supplier Part Number 1: 738-RMCF1206FT2R00CT-ND
R45 R80 R81 = NS00870: RES 100 OHM 1% 1/10W 0603; Alternatives: Generic; Part Number: NS00870; Type: R; Value: 100R, 1%, 1/10W; Supplier 1: Digi-Key; Supplier Part Number 1: RMCF0603FT100RCT-ND
R71 R83-R88 = NS00820: RES 10K OHM 1% 1/10W 0603; Alternatives: Generic; Part Number: NS00820; Type: R; Value: 10k, 1%, 1/10W; Supplier 1: Digi-Key; Supplier Part Number 1: RMCF0603FT10K0CT-ND
R74-R76 R82 R89-R91 = NS00876: RES 0 OHM JUMPER 1/10W 0603; Alternatives: Generic; Part Number: NS00876; Type: R; Value: 0R, 1/10W; Supplier 1: Digi-Key; Supplier Part Number 1: RMCF0603ZT0R00CT-ND
R118 R120 R122 R124 = NS00835: RES 100K OHM 1% 1/10W 0603; Alternatives: Generic; Part Number: NS00835; Type: R; Value: 100k, 1%, 1/10W; Supplier 1: Digi-Key; Supplier Part Number 1: RMCF0603FT100KCT-ND
R119 R121 R123 = NS00834: RES 15K OHM 1% 1/10W 0603; Alternatives: Generic; Part Number: NS00834; Type: R; Value: 15k, 1%, 1/10W; Supplier 1: Digi-Key; Supplier Part Number 1: 1292-WR06X1502FTLCT-ND
R125 = NS00823: RES 26.7K OHM 1% 1/10W 0603; Alternatives: Generic; Part Number: NS00823; Type: R; Value: 26.7k, 1%, 1/10W; Supplier 1: Digi-Key; Supplier Part Number 1: RMCF0603FT26K7
U11 = NS00919: IC VREF SERIES 0.1% SOT23-6; Part Number: NS00919; Type: IC; Value: MCP1501T-10E/CHY; ComponentLink1Description: Datasheet; ComponentLink1URL: H:\Doc\Microchip\20005474E-1.pdf; Supplier 1: Digi-Key; Supplier Part Number 1: MCP1501T-10E/CHYCT-ND
U12-U15 U19 = NS00913: TVS DIODE 5VWM 20VC 8-SOP; Part Number: NS00913; Type: IC; Value: STSP84050U800; ComponentLink1Description: Datasheet; ComponentLink1URL: H:\Doc\Eaton\eaton-stsp84xxxxxx-tvs-diode-array-esd-suppressor-data-sheet.pdf; Supplier 1: Digi-Key; Supplier Part Number 1: 283-STSP84050U800CT-ND